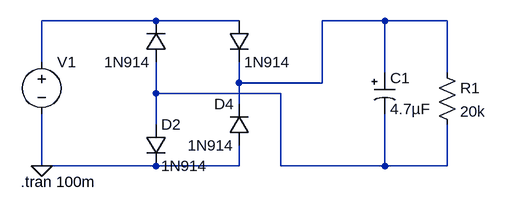
[diagram p0: schematic Full_wave_rectifier2.asc]
Full_wave_rectifier2.asc, the LTspice schematic file:
Version 4
SHEET 1 880 680
WIRE 224 48 48 48
WIRE 352 48 224 48
WIRE 576 48 480 48
WIRE 672 48 576 48
WIRE 48 112 48 48
WIRE 576 128 576 48
WIRE 672 128 672 48
WIRE 352 144 352 112
WIRE 480 144 480 48
WIRE 480 144 352 144
WIRE 224 160 224 112
WIRE 416 160 224 160
WIRE 352 176 352 144
WIRE 224 208 224 160
WIRE 48 272 48 192
WIRE 224 272 48 272
WIRE 352 272 352 240
WIRE 352 272 224 272
WIRE 416 272 416 160
WIRE 576 272 576 192
WIRE 576 272 416 272
WIRE 672 272 672 208
WIRE 672 272 576 272
FLAG 48 272 0
SYMBOL voltage 48 96 R0
WINDOW 3 24 96 Invisible 2
WINDOW 123 0 0 Left 0
WINDOW 39 0 0 Left 0
SYMATTR Value SINE(0 5 50)
SYMATTR InstName V1
SYMBOL diode 240 112 R180
WINDOW 0 24 64 Invisible 2
WINDOW 3 24 0 Left 2
SYMATTR InstName D1
SYMATTR Value 1N914
SYMBOL diode 336 48 R0
WINDOW 0 24 0 Invisible 2
SYMATTR InstName D3
SYMATTR Value 1N914
SYMBOL polcap 560 128 R0
WINDOW 3 24 56 Left 2
SYMATTR Value 4.7µF
SYMATTR InstName C1
SYMATTR Description Capacitor
SYMATTR Type cap
SYMATTR SpiceLine V=16 Irms=3.72678 Rser=0 Lser=0
SYMBOL res 656 112 R0
SYMATTR InstName R1
SYMATTR Value 20k
SYMBOL diode 368 240 R180
WINDOW 0 24 64 Left 2
WINDOW 3 24 0 Left 2
SYMATTR InstName D4
SYMATTR Value 1N914
SYMBOL diode 208 208 R0
SYMATTR InstName D2
SYMATTR Value 1N914
TEXT 16 296 Left 2 !.tran 100m

The netlist it stands for:
* Full_wave_rectifier2.asc
V1 N001 0 SINE(0 5 50)
D1 N003 N001 1N914
D3 N001 N002 1N914
C1 N002 N003 4.7µF V=16 Irms=3.72678 Rser=0 Lser=0
R1 N002 N003 20k
D4 0 N002 1N914
D2 N003 0 1N914
.model D D
.lib standard.dio
.tran 100m
.backanno
.end